# EAGLE design Skaarhoj BI8-SE-C201 (EAGLE 6.2)
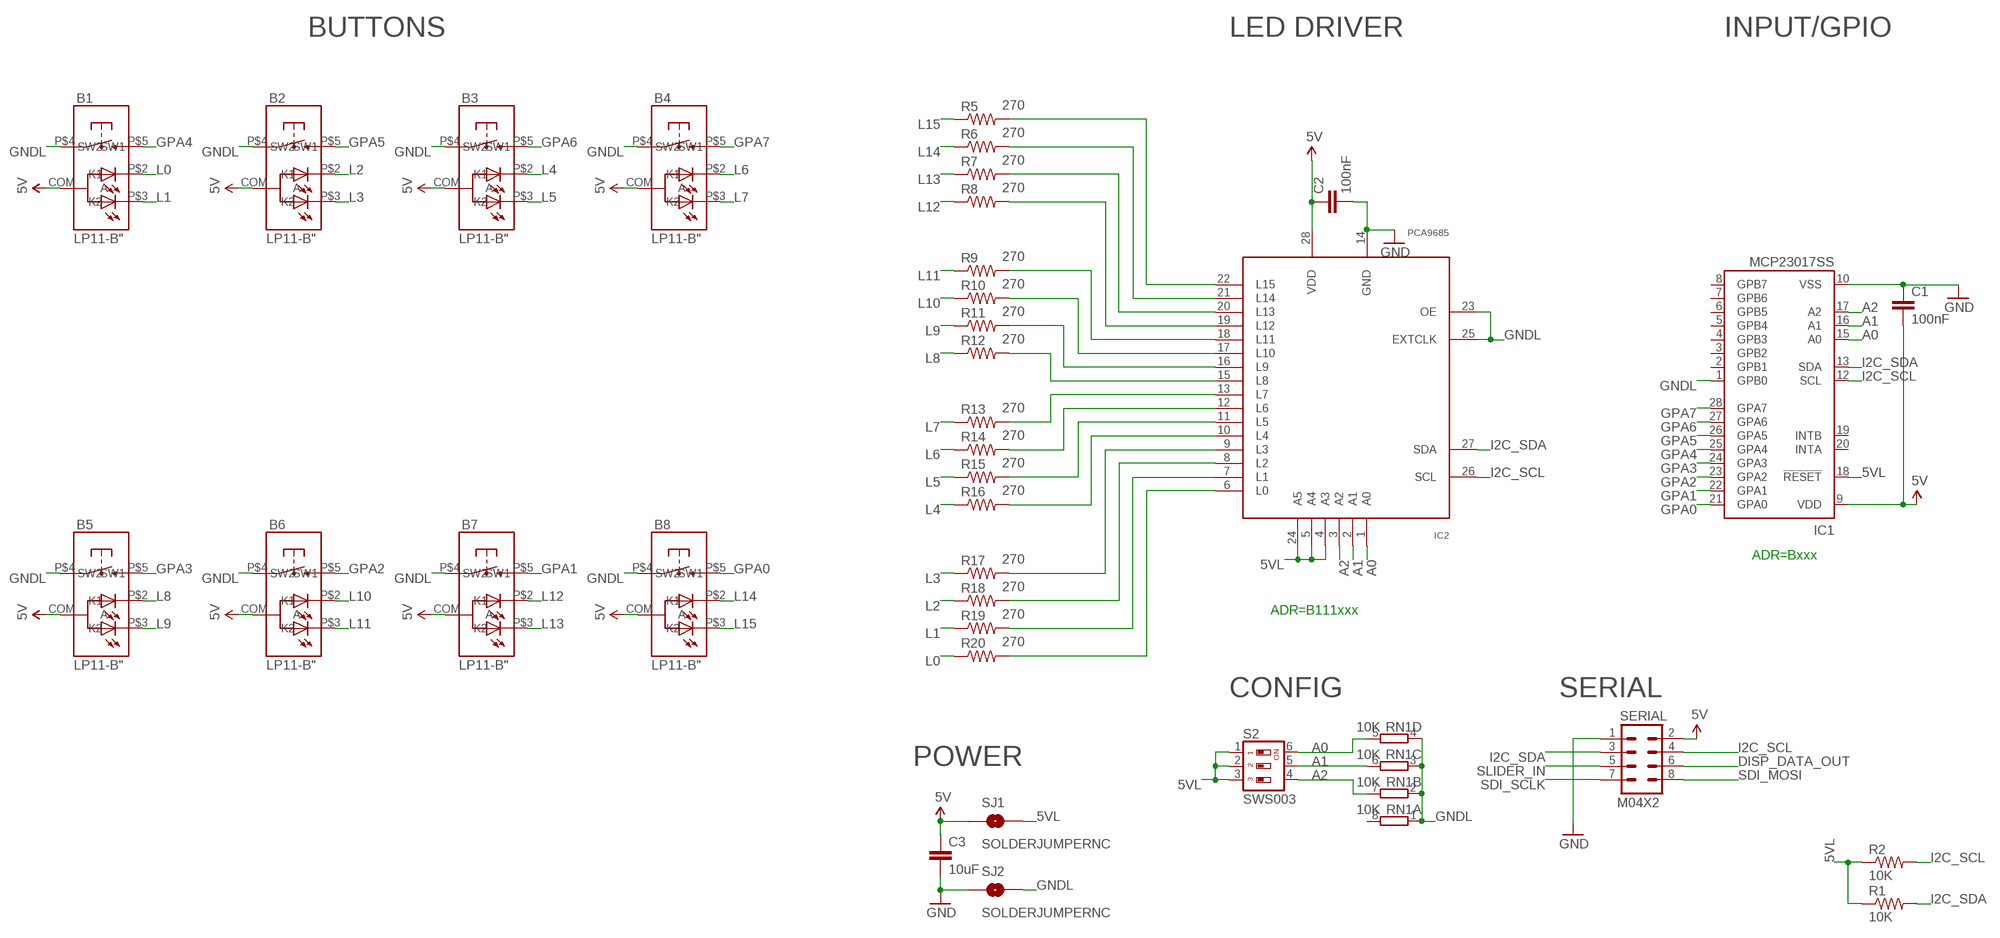
[diagram p0: schematic, sheet 1]

## Parts
B1  LP11-B"  [LP11]
B2  LP11-B"  [LP11]
B3  LP11-B"  [LP11]
B4  LP11-B"  [LP11]
B5  LP11-B"  [LP11]
B6  LP11-B"  [LP11]
B7  LP11-B"  [LP11]
B8  LP11-B"  [LP11]
C1  100nF  CAP0603-CAP  [0603-CAP]
C2  100nF  CAP0603-CAP  [0603-CAP]
C3  10uF  CAP0805  [0805]
IC1  MCP23017SS  [SSOP28]
IC2  PCA9685  [TSSOP28]
R1  10K  RESISTOR0603-RES  [0603-RES]
R2  10K  RESISTOR0603-RES  [0603-RES]
R5  270  RESISTOR0603-RES  [0603-RES]
R6  270  RESISTOR0603-RES  [0603-RES]
R7  270  RESISTOR0603-RES  [0603-RES]
R8  270  RESISTOR0603-RES  [0603-RES]
R9  270  RESISTOR0603-RES  [0603-RES]
R10  270  RESISTOR0603-RES  [0603-RES]
R11  270  RESISTOR0603-RES  [0603-RES]
R12  270  RESISTOR0603-RES  [0603-RES]
R13  270  RESISTOR0603-RES  [0603-RES]
R14  270  RESISTOR0603-RES  [0603-RES]
R15  270  RESISTOR0603-RES  [0603-RES]
R16  270  RESISTOR0603-RES  [0603-RES]
R17  270  RESISTOR0603-RES  [0603-RES]
R18  270  RESISTOR0603-RES  [0603-RES]
R19  270  RESISTOR0603-RES  [0603-RES]
R20  270  RESISTOR0603-RES  [0603-RES]
RN1  10K  4R-NCAY16  [CAY16_HAND]
S2  SWS003  [SMS-003]
SERIAL  M04X2  [2X4]
SJ1  SOLDERJUMPERNC  [SJ_2S]
SJ2  SOLDERJUMPERNC  [SJ_2S]

## Nets
5V [Power]: B1.COM(A) B2.COM(A) B3.COM(A) B4.COM(A) B5.COM(A) B6.COM(A) B7.COM(A) B8.COM(A) C1.2 C2.1 C3.1 IC1.9(VDD) IC2.28(VDD) SERIAL.2 SJ1.1
5VL: IC1.18(!RESET) IC2.4(A3) IC2.5(A4) IC2.24(A5) R1.1 R2.1 S2.1 S2.2 S2.3 SJ1.2
A0: IC1.15(A0) IC2.1(A0) RN1.5 S2.6
A1: IC1.16(A1) IC2.2(A1) RN1.6 S2.5
A2: IC1.17(A2) IC2.3(A2) RN1.7 S2.4
DISP_DATA_OUT: SERIAL.6
GND [Power]: C1.1 C2.2 C3.2 IC1.10(VSS) IC2.14(GND) SERIAL.1 SJ2.1
GNDL: B1.P$4(SW1) B2.P$4(SW1) B3.P$4(SW1) B4.P$4(SW1) B5.P$4(SW1) B6.P$4(SW1) B7.P$4(SW1) B8.P$4(SW1) IC1.1(GPB0) IC2.23(OE) IC2.25(EXTCLK) RN1.1 RN1.2 RN1.3 RN1.4 SJ2.2
GPA0: B8.P$5(SW2) IC1.21(GPA0)
GPA1: B7.P$5(SW2) IC1.22(GPA1)
GPA2: B6.P$5(SW2) IC1.23(GPA2)
GPA3: B5.P$5(SW2) IC1.24(GPA3)
GPA4: B1.P$5(SW2) IC1.25(GPA4)
GPA5: B2.P$5(SW2) IC1.26(GPA5)
GPA6: B3.P$5(SW2) IC1.27(GPA6)
GPA7: B4.P$5(SW2) IC1.28(GPA7)
I2C_SCL: IC1.12(SCL) IC2.26(SCL) R2.2 SERIAL.4
I2C_SDA: IC1.13(SDA) IC2.27(SDA) R1.2 SERIAL.3
L0: B1.P$2(K1) R20.1
L1: B1.P$3(K2) R19.1
L2: B2.P$2(K1) R18.1
L3: B2.P$3(K2) R17.1
L4: B3.P$2(K1) R16.1
L5: B3.P$3(K2) R15.1
L6: B4.P$2(K1) R14.1
L7: B4.P$3(K2) R13.1
L8: B5.P$2(K1) R12.1
L9: B5.P$3(K2) R11.1
L10: B6.P$2(K1) R10.1
L11: B6.P$3(K2) R9.1
L12: B7.P$2(K1) R8.1
L13: B7.P$3(K2) R7.1
L14: B8.P$2(K1) R6.1
L15: B8.P$3(K2) R5.1
N$4: IC2.13(L7) R13.2
N$5: IC2.12(L6) R14.2
N$7: IC2.11(L5) R15.2
N$9: IC2.10(L4) R16.2
N$10: IC2.9(L3) R17.2
N$11: IC2.8(L2) R18.2
N$12: IC2.7(L1) R19.2
N$19: IC2.6(L0) R20.2
N$20: IC2.15(L8) R12.2
N$21: IC2.16(L9) R11.2
N$22: IC2.17(L10) R10.2
N$23: IC2.18(L11) R9.2
N$24: IC2.19(L12) R8.2
N$25: IC2.20(L13) R7.2
N$26: IC2.21(L14) R6.2
N$27: IC2.22(L15) R5.2
SDI_MOSI: SERIAL.8
SDI_SCLK: SERIAL.7
SLIDER_IN: SERIAL.5
Unconnected: IC1.2(GPB1) IC1.3(GPB2) IC1.4(GPB3) IC1.5(GPB4) IC1.6(GPB5) IC1.7(GPB6) IC1.8(GPB7) IC1.19(INTB) IC1.20(INTA) RN1.8

## Notes on the sheet
- BUTTONS | LED DRIVER | INPUT/GPIO
- ADR=Bxxx
- ADR=B111xxx
- CONFIG | SERIAL
- POWER

## Library data of the parts
B1-B8 = SKAARHOJ:LP11-B
C1-C3 = SparkFun:CAP: Capacitor Standard 0603 ceramic capacitor, and 0.1" leaded capacitor.
IC1 = microchip:MCP23017: http://ww1.microchip.com/downloads/en/DeviceDoc/21952a.pdf Source: http://ww1.microchip.com/downloads/en/DeviceDoc/21952a.pdf; MF: MICROCHIP; MPN: MCP23017-E/SS; OC_FARNELL: 1467674; OC_NEWARK: 31K2960
IC2 = wsmith:PCA9685
R1 R2 R5-R20 = SparkFun:RESISTOR: Resistor Basic schematic elements and footprints for 0603, 1206, and PTH resistors.
RN1 = SKAARHOJ:4R-N: Array Chip Resistor Source: RS Component / Phycomp; OC_FARNELL: unknown; OC_NEWARK: unknown
S2 = smd-special:SWS003: SMD Dip Switch 3 pol.
SERIAL = SparkFun:M04X2
SJ1 SJ2 = SparkFun:SOLDERJUMPER: Solder Jumper Standard SMD solder jumper. Used to automate production. Two varients : Normally Open and Normally Closed are the same, but have different paste layers. NC will have a large amount of paste and should jumper during reflow.

## Net classes
0 default: width 0.203 mm, drill 0.406 mm, clearance 0.203 mm
1 Power: width 0.406 mm, drill 0.61 mm, clearance 0.203 mm

## Board
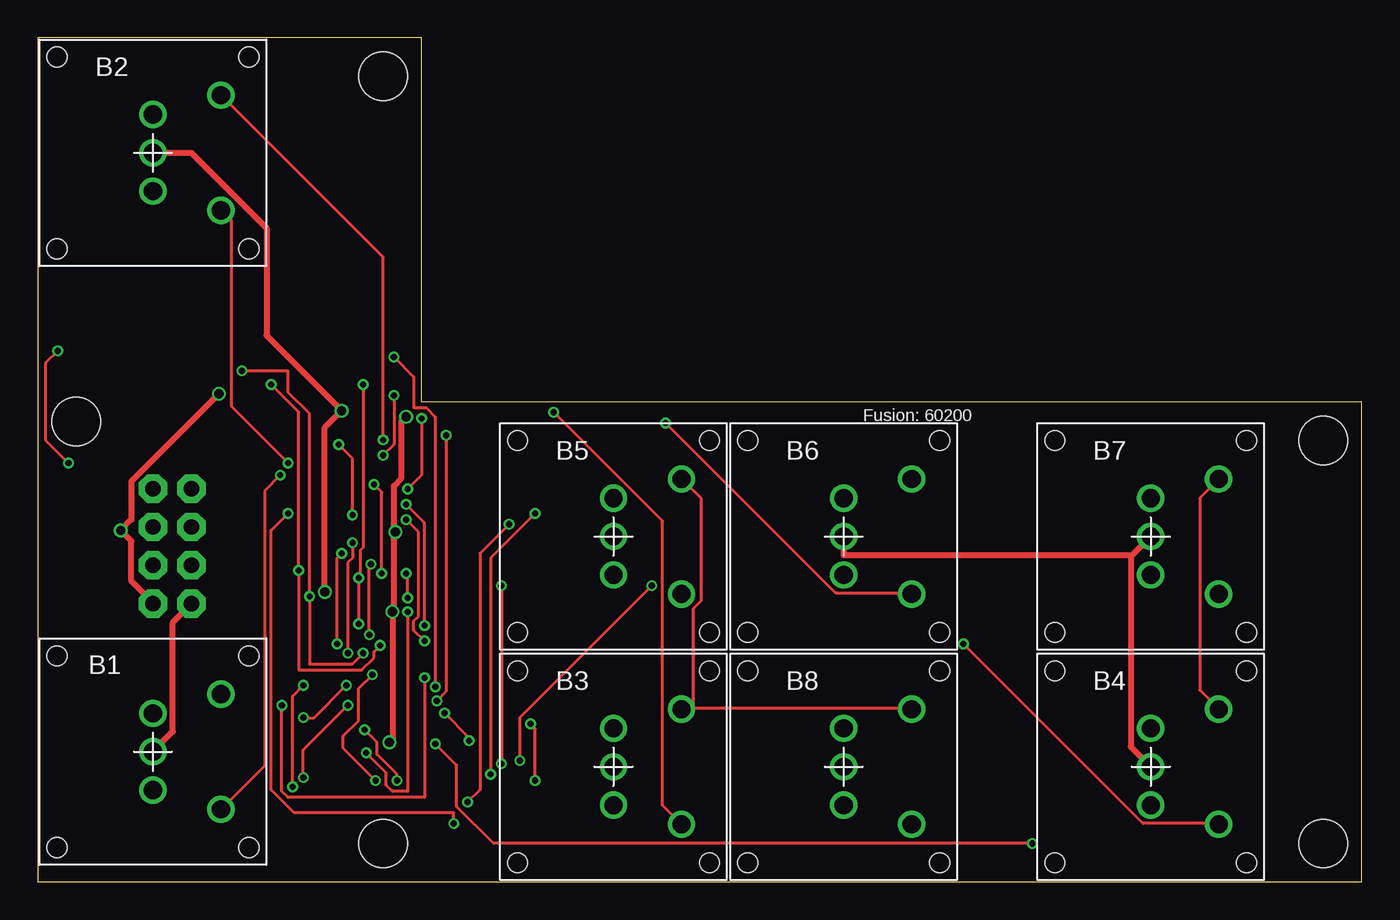
[diagram p1: board, top side]
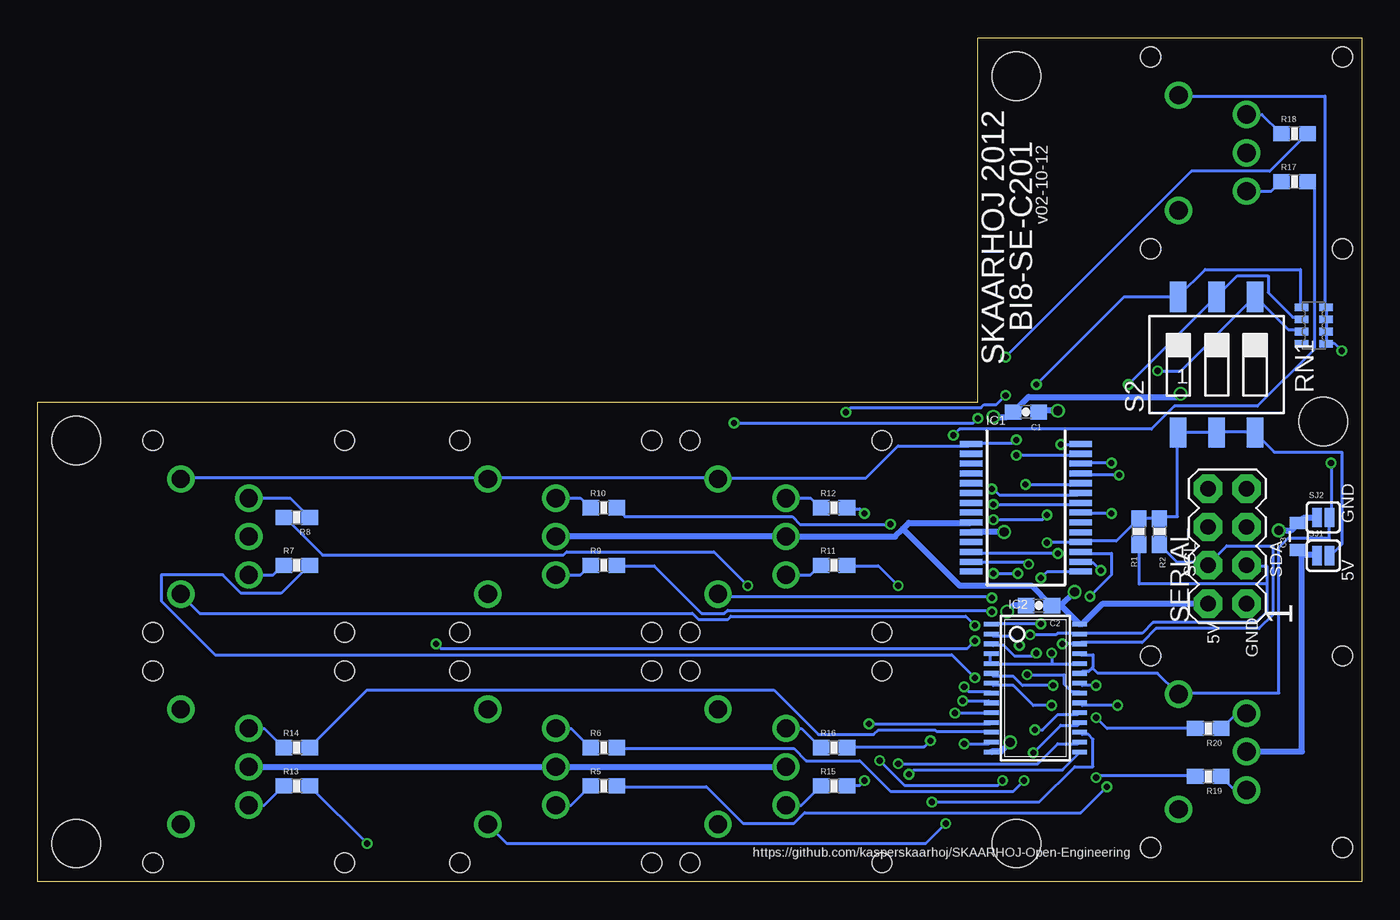
[diagram p2: board, bottom side, seen from below]

Size 87.63 x 55.88 mm. Coordinates in mm from the lower left corner, seen from the top.
Outline: 0,0 87.63,0 87.63,31.75 25.4,31.75 25.4,55.88 0,55.88 0,0
Copper layers (1*16): Top 0.035mm / dielectric 1.5mm / Bottom 0.035mm
Design rules: minimum track width 6mil, minimum drill 12mil, track to track 6mil, track to pad 6mil, pad to pad 6mil, via to via 6mil, smd to smd 0mil, copper to edge 10mil, drill to drill 10mil, minimum pad ring 10mil, minimum via ring 6mil, stop-mask expansion 2mil, vias tented up to drill 100mil, thermal gap 10mil
Holes 3.2 mm at 22.86,53.34 22.86,2.54 85.09,2.54 85.09,29.21 2.54,30.48

### Footprints (pad centres in the part's own frame; a part is rotated, then mirrored left to right if it is on the bottom)
LP11 = drill 1.2: COM 0,0; P$2 0,2.54; P$3 0,-2.54; P$4 4.5,3.81; P$5 4.5,-3.81 | hole 1.3: -6.35,6.35; 6.35,6.35; 6.35,-6.35; -6.35,-6.35
0603-CAP = smd 1.1 x 1: 1 -0.85,0; 2 0.85,0
0805 = smd 0.8 x 1.2: 1 -0.9,0; 2 0.9,0
SSOP28 = smd 0.4 x 1.5: 1 -4.225,-3.625; 2 -3.575,-3.625; 3 -2.925,-3.625; 4 -2.275,-3.625; 5 -1.625,-3.625; 6 -0.975,-3.625; 7 -0.325,-3.625; 8 0.325,-3.625; 9 0.975,-3.625; 10 1.625,-3.625; 11 2.275,-3.625; 12 2.925,-3.625; 13 3.575,-3.625; 14 4.225,-3.625; 15 4.225,3.625; 16 3.575,3.625; 17 2.925,3.625; 18 2.275,3.625; 19 1.625,3.625; 20 0.975,3.625; 21 0.325,3.625; 22 -0.325,3.625; 23 -0.975,3.625; 24 -1.625,3.625; 25 -2.275,3.625; 26 -2.925,3.625; 27 -3.575,3.625; 28 -4.225,3.625
TSSOP28 = smd 0.305 x 0.991: 1 -4.225,-2.918; 2 -3.575,-2.918; 3 -2.925,-2.918; 4 -2.275,-2.918; 5 -1.625,-2.918; 6 -0.975,-2.918; 7 -0.325,-2.918; 8 0.325,-2.918; 9 0.975,-2.918; 10 1.625,-2.918; 11 2.275,-2.918; 12 2.925,-2.918; 13 3.575,-2.918; 14 4.225,-2.918; 15 4.225,2.918; 16 3.575,2.918; 17 2.925,2.918; 18 2.275,2.918; 19 1.625,2.918; 20 0.975,2.918; 21 0.325,2.918; 22 -0.325,2.918; 23 -0.975,2.918; 24 -1.625,2.918; 25 -2.275,2.918; 26 -2.925,2.918; 27 -3.575,2.918; 28 -4.225,2.918
0603-RES = smd 1.1 x 1: 1 -0.85,0; 2 0.85,0
CAY16_HAND = smd 0.5 x 0.904: 1 -1.2,-0.813; 2 -0.4,-0.813; 3 0.4,-0.813; 4 1.2,-0.813; 5 1.2,0.813; 6 0.4,0.813; 7 -0.4,0.813; 8 -1.2,0.813
SMS-003 = smd 1.092 x 2.007: 1 -2.54,-4.496; 2 0,-4.496; 3 2.54,-4.496; 4 2.54,4.496; 5 0,4.496; 6 -2.54,4.496
2X4 = drill 1.016 pad 1.88 octagon: 1 -3.81,-1.27; 2 -3.81,1.27; 3 -1.27,-1.27; 4 -1.27,1.27; 5 1.27,-1.27; 6 1.27,1.27; 7 3.81,-1.27; 8 3.81,1.27
SJ_2S = smd 0.635 x 1.27: 1 -0.412,0; 2 0.412,0

### Placement (x,y rotation side)
B1  7.62,8.62 0 top
B2  7.62,48.26 0 top
B3  38.1,7.62 0 top
B4  73.66,7.62 0 top
B5  38.1,22.86 0 top
B6  53.34,22.86 0 top
B7  73.66,22.86 0 top
B8  53.34,7.62 0 top
C1  22.23,31.11 0 bottom
C2  21.36,18.29 180 bottom
C3  4.17,22.86 90 bottom
IC1  22.23,24.77 270 bottom
IC2  21.59,12.83 270 bottom
R1  14.76,23.19 270 bottom
R2  13.39,23.19 270 bottom
R5  50.16,6.35 0 bottom
R6  50.16,8.89 0 bottom
R7  70.48,20.95 0 bottom
R8  70.48,24.13 180 bottom
R9  50.16,20.95 0 bottom
R10  50.16,24.77 0 bottom
R11  34.92,20.95 0 bottom
R12  34.92,24.77 0 bottom
R13  70.48,6.35 0 bottom
R14  70.48,8.89 0 bottom
R15  34.92,6.35 0 bottom
R16  34.92,8.89 0 bottom
R17  4.45,46.35 0 bottom
R18  4.45,49.53 0 bottom
R19  10.16,6.99 180 bottom
R20  10.16,10.16 180 bottom
RN1  3.17,36.83 90 bottom
S2  9.6,34.24 0 bottom
SERIAL  8.89,22.23 90 bottom
SJ1  2.54,21.59 0 bottom
SJ2  2.54,24.13 0 bottom

### Tracks (layer width: path | path; a pad name or v marks a point on that pad's centre or on a via)
5V  (via drill 0.61)
  Top 0.406: B4.COM 72.34,8.94 72.34,21.54 | B7.COM 72.34,21.54 | B2.COM 10.16,48.26 15.14,43.28 15.14,36.17 v20.12,31.19 19,30.07 v19,19.2 | SERIAL.2 10.16,18.39 8.94,17.17 8.94,9.96 7.62,8.64 B1.COM | B6.COM 53.34,21.64 72.24,21.64 72.34,21.54
  Bottom 0.406: B3.COM B8.COM B4.COM | v20.12,31.19 21.34,31.19 C1.2 | 19.91,18.29 18.69,17.07 IC2.28 18.49,17.07 17.17,18.39 10.16,18.39 SERIAL.2 | 19.91,18.29 C2.1 20.62,18.39 21.84,19.61 26.62,19.61 30.38,23.37 | 3.86,21.64 4.17,21.95 C3.1 | 3.86,21.64 3.05,21.64 SJ1.1 | 3.86,21.64 3.96,21.54 3.96,8.64 7.62,8.64 B1.COM | 30.38,23.37 30.89,22.86 B5.COM B6.COM | 30.38,23.37 29.97,23.77 25.91,23.77 IC1.9 | 19.91,18.29 v19,19.2
5VL  (via drill 0.41)
  Top 0.203: v20.52,15.14 20.52,21.13 20.83,21.44 v20.83,22.45
  Bottom 0.203: SJ1.2 2.03,21.64 1.32,22.35 1.32,28.45 5.79,28.45 7.01,29.67 S2.3 7.11,29.77 9.55,29.77 S2.2 9.65,29.77 12.09,29.77 S2.1 12.19,29.67 12.19,24.18 13.41,24.18 R2.1 13.41,24.08 14.73,24.08 R1.1 14.83,23.98 16.26,22.55 18.59,22.55 IC1.18 18.69,22.45 v20.83,22.45 | 20.52,14.43 24.49,14.43 IC2.5 24.59,14.53 24.59,15.04 IC2.4 | 20.52,14.43 18.69,14.43 IC2.24 | v20.52,15.14 20.52,14.43
A0  (via drill 0.41)
  Top 0.203: v21.23,17.07 v21.23,20.12 21.34,20.22 21.34,21.95 21.54,22.15 v21.54,32.92
  Bottom 0.203: v21.23,17.07 24.49,17.07 IC2.1 | v21.23,20.12 20.83,20.52 18.69,20.52 IC1.15 | RN1.5 4.06,38.1 4.06,40.54 10.36,40.54 12.09,38.81 S2.6 12.19,38.71 15.75,38.71 v21.54,32.92
A1  (via drill 0.41)
  Top 0.203: v22.66,15.65 22.25,15.24 22.25,14.83 21.44,14.02 17.27,14.02 v17.27,20.62 17.27,31.09 v15.44,32.92
  Bottom 0.203: RN1.6 4.06,37.29 4.17,37.39 4.57,37.39 6.2,39.01 6.2,40.13 8.23,40.13 9.55,38.81 S2.5 9.65,38.71 v15.44,32.92 | v22.66,15.65 23.27,16.26 24.38,16.26 24.49,16.36 IC2.2 | v17.27,20.62 17.78,21.13 18.59,21.13 IC1.16
A2  (via drill 0.41)
  Top 0.203: v21.54,15.14 20.83,14.43 17.98,14.43 v17.98,18.9 17.98,30.99 16.56,32.41 16.56,33.83 v13.51,33.83
  Bottom 0.203: RN1.7 4.06,36.47 4.17,36.58 4.88,36.58 7.01,38.71 S2.4 7.11,38.71 11.99,33.83 v13.51,33.83 | v21.54,15.14 21.74,14.94 22.96,14.94 23.67,15.65 24.38,15.65 24.49,15.75 IC2.3 | v17.98,18.9 16.56,20.32 16.56,21.74 18.59,21.74 IC1.17
GND  (via drill 0.61)
  Top 0.406: SERIAL.1 7.62,18.49 6.2,19.91 6.2,22.55 v5.49,23.27 6.2,23.98 6.2,26.52 v11.99,32.31 | v23.27,9.25 23.47,9.45 v23.47,17.88 23.57,17.98 23.57,23.16 | v24.38,30.79 24.08,30.48 24.08,26.72 23.57,26.21 23.57,23.16 | v23.67,23.16 23.57,23.16
  Bottom 0.406: SJ2.1 3.05,24.08 3.86,24.08 4.17,23.77 C3.2 4.27,23.67 4.67,23.27 v5.49,23.27 | v23.27,9.25 23.88,8.64 24.49,8.64 IC2.14 | v23.47,17.88 23.06,18.29 C2.2 | v24.38,30.79 23.47,30.79 23.16,31.09 C1.1 22.96,31.19 22.05,32.11 12.19,32.11 v11.99,32.31 | v23.67,23.16 25.81,23.16 IC1.10
GNDL  (via drill 0.41)
  Top 0.203: B4.P$4 78.13,11.48 76.91,12.7 76.91,25.4 78.13,26.62 B7.P$4 | 43.38,11.48 57.81,11.48 B8.P$4 | 43.38,11.48 42.67,11.48 B3.P$4 43.38,11.48 | 43.38,11.48 43.38,18.09 43.89,18.59 43.89,25.4 42.67,26.62 B5.P$4 | v22.86,29.26 22.86,41.35 12.19,52.02 B2.P$4 | v2.03,27.74 0.51,29.26 0.51,34.34 v1.32,35.15
  Bottom 0.203: 17.83,14.17 17.78,14.22 17.78,15.04 18.59,15.04 IC2.25 | 17.83,14.17 18.09,13.92 18.49,13.92 18.59,13.82 IC2.23 | 17.83,14.17 17.48,13.82 13.51,13.82 12.19,12.5 B1.P$4 12.09,12.5 5.49,12.5 5.49,22.15 4.88,22.76 2.13,22.76 2.13,24.08 SJ2.2 2.03,24.18 v2.03,27.74 | B2.P$4 12.09,52.02 2.44,52.02 2.44,38.1 RN1.4 2.34,38 2.34,37.29 RN1.3 2.34,37.19 2.34,36.47 RN1.2 2.34,36.37 2.34,35.66 RN1.1 2.23,35.66 1.83,35.66 v1.32,35.15 | B7.P$4 78.13,26.72 57.91,26.72 B6.P$4 57.81,26.72 42.67,26.72 B5.P$4 42.57,26.72 32.82,26.72 30.68,28.85 26.01,28.85 25.91,28.96 IC1.1 25.81,29.06 23.06,29.06 v22.86,29.26
GPA0  (via drill 0.41)
  Top 0.203: v16.56,24.38 15.44,23.27 15.44,6.1 16.97,4.57 27.53,4.57 v27.53,3.86
  Bottom 0.203: v16.56,24.38 18.59,24.38 IC1.21 | v27.53,3.86 28.85,2.54 56.59,2.54 57.81,3.76 B8.P$5
GPA1  (via drill 0.41)
  Top 0.203: v24.38,24.99 25.6,23.77 v25.6,16.97
  Bottom 0.203: v24.38,24.99 18.69,24.99 IC1.22 | v25.6,16.97 26.21,17.58 41.76,17.58 41.96,17.37 43.89,17.37 44.3,17.78 76.91,17.78 78.13,19 B7.P$5
GPA2  (via drill 0.41)
  Top 0.203: v24.49,26.01 25.4,26.92 v25.4,30.68 | v41.55,30.38 52.83,19.1 57.81,19.1 B6.P$5
  Bottom 0.203: v24.49,26.01 24.38,26.01 23.98,25.6 18.8,25.6 18.69,25.7 IC1.23 | v25.4,30.68 25.7,30.38 v41.55,30.38
GPA3  (via drill 0.41)
  Top 0.203: v22.25,26.31 22.76,25.81 v22.76,20.42 | v24.38,20.42 24.49,20.32 v24.49,18.8
  Bottom 0.203: v22.25,26.31 18.69,26.31 IC1.24 | v24.38,20.42 v22.76,20.42 | v24.49,18.8 24.59,18.9 42.47,18.9 42.57,19 B5.P$5
GPA4  (via drill 0.41)
  Top 0.203: v16.05,26.92 15.04,25.91 15.04,7.72 12.19,4.88 B1.P$5
  Bottom 0.203: v16.05,26.92 18.49,26.92 18.59,27.03 IC1.25
GPA5  (via drill 0.41)
  Top 0.203: v16.56,27.74 12.8,31.5 12.8,43.79 12.19,44.4 B2.P$5
  Bottom 0.203: v16.56,27.74 18.59,27.74 IC1.26
GPA6  (via drill 0.41)
  Top 0.203: v22.86,28.25 23.57,28.96 v23.57,32.21 | v34.14,31.09 41.35,23.88 41.35,5.08 42.57,3.86 B3.P$5
  Bottom 0.203: v22.86,28.25 18.69,28.25 IC1.27 | v23.57,32.21 24.18,31.6 24.99,31.6 25.2,31.39 33.83,31.39 v34.14,31.09
GPA7  (via drill 0.41)
  Top 0.203: v19.91,28.96 20.83,28.04 v20.83,24.28 | v24.38,23.98 25.2,23.16 25.2,17.58 24.89,17.27 24.89,16.66 v25.6,15.95 | v61.27,15.75 73.15,3.86 78.13,3.86 B4.P$5
  Bottom 0.203: v19.91,28.96 18.69,28.96 IC1.28 | v20.83,24.28 21.13,23.98 v24.38,23.98 | v25.6,15.95 26.11,15.44 60.96,15.44 v61.27,15.75
I2C_SCL  (via drill 0.41)
  Top 0.203: v20.12,21.74 19.81,21.44 v19.81,15.75
  Bottom 0.203: R2.2 13.31,22.25 12.19,21.13 10.16,21.13 SERIAL.4 10.16,21.03 8.94,22.25 5.89,22.25 5.89,17.68 6.81,16.76 13.61,16.76 14.53,15.85 18.59,15.85 IC2.26 18.69,15.75 v19.81,15.75 | v20.12,21.74 25.81,21.74 IC1.12
I2C_SDA  (via drill 0.41)
  Top 0.203: v22.05,21.03 21.95,20.93 v21.95,16.36
  Bottom 0.203: 6.3,19.71 6.3,20.93 7.62,20.93 SERIAL.3 | 6.3,19.71 6.3,17.88 7.01,17.17 13.82,17.17 14.53,16.46 18.59,16.46 IC2.27 18.69,16.46 20.12,16.46 20.22,16.36 v21.95,16.36 | 6.3,19.71 14.73,19.71 14.73,22.25 R1.2 | v22.05,21.03 22.15,21.13 25.81,21.13 IC1.13
L0
  Bottom 0.203: R20.1 9.25,10.16 8.33,11.07 7.62,11.07 B1.P$2
L1
  Bottom 0.203: R19.1 9.25,6.91 8.43,6.1 7.62,6.1 B1.P$3
L2
  Bottom 0.203: B2.P$2 6.6,50.8 5.38,49.58 R18.1
L3
  Bottom 0.203: B2.P$3 5.99,45.72 5.38,46.33 R17.1
L4
  Bottom 0.203: B3.P$2 37.08,10.16 35.87,8.94 R16.1
L5
  Bottom 0.203: B3.P$3 37.08,5.08 35.87,6.3 R15.1
L6
  Bottom 0.203: B4.P$2 72.64,10.16 71.42,8.94 R14.1
L7
  Bottom 0.203: B4.P$3 72.64,5.08 71.42,6.3 R13.1
L8
  Bottom 0.203: B5.P$2 36.47,25.4 35.87,24.79 R12.1
L9
  Bottom 0.203: B5.P$3 36.47,20.32 35.87,20.93 R11.1
L10
  Bottom 0.203: B6.P$2 51.71,25.4 51.1,24.79 R10.1
L11
  Bottom 0.203: B6.P$3 51.71,20.32 51.1,20.93 R9.1
L12
  Bottom 0.203: B7.P$2 70.92,25.4 69.7,24.18 R8.1
L13
  Bottom 0.203: B7.P$3 72.03,20.32 71.42,20.93 R7.1
L14
  Bottom 0.203: B8.P$2 52.32,10.16 51.1,8.94 R6.1
L15
  Bottom 0.203: B8.P$3 52.32,5.08 51.1,6.3 R5.1
N$4  (via drill 0.41)
  Top 0.203: v26.31,9.14 27.74,7.72 27.74,4.98 30.18,2.54 v65.84,2.54
  Bottom 0.203: v26.31,9.14 24.69,9.14 24.59,9.25 IC2.13 | v65.84,2.54 69.6,6.3 R13.2
N$5
  Bottom 0.203: IC2.12 24.59,9.96 28.14,9.96 28.25,10.06 32,10.06 32.31,9.75 35.97,9.75 38.91,12.7 65.84,12.7 69.6,8.94 R14.2
N$7  (via drill 0.41)
  Top 0.203: v32.61,10.46 32.92,10.16 v32.92,6.71
  Bottom 0.203: v32.61,10.46 24.59,10.46 IC2.11 | v32.92,6.71 33.22,6.4 34.04,6.4 R15.2
N$9  (via drill 0.41)
  Top 0.203: v26.92,11.18 28.55,9.55 v28.55,9.35
  Bottom 0.203: v26.92,11.18 24.59,11.18 IC2.10 | v28.55,9.35 28.96,8.94 34.04,8.94 R16.2
N$10  (via drill 0.41)
  Top 0.203: v26.42,11.99 27.03,12.6 v27.03,29.57
  Bottom 0.203: v26.42,11.99 24.69,11.99 24.59,11.89 IC2.9 | v27.03,29.57 26.62,29.97 13.92,29.97 12.39,31.5 6.91,31.5 3.15,35.26 3.15,46.33 3.56,46.33 R17.2
N$11  (via drill 0.41)
  Top 0.203: v26.31,12.9 26.31,30.79 25.7,31.39 24.89,31.39 24.89,33.43 v23.57,34.75
  Bottom 0.203: v26.31,12.9 26.01,12.6 24.59,12.6 IC2.8 | v23.57,34.75 11.28,47.04 6.1,47.04 3.66,49.48 R18.2
N$12  (via drill 0.41)
  Top 0.203: v20.52,11.68 17.58,8.74 v17.58,6.91
  Bottom 0.203: v20.52,11.68 21.74,11.68 23.06,13.01 24.38,13.01 24.49,13.11 IC2.7 | v17.58,6.91 17.48,7.01 11.07,7.01 R19.2
N$19  (via drill 0.41)
  Top 0.203: v20.42,13.01 18.29,10.87 v17.58,10.87
  Bottom 0.203: v20.42,13.01 22.45,13.01 23.06,13.61 24.38,13.61 24.49,13.72 IC2.6 | v17.58,10.87 16.87,10.16 R20.2
N$20  (via drill 0.41)
  Top 0.203: v29.97,7.11 29.97,21.44 v32.92,24.38
  Bottom 0.203: v29.97,7.11 29.67,7.42 19.81,7.42 18.69,8.53 IC2.15 | v32.92,24.38 33.22,24.69 34.04,24.69 R12.2
N$21  (via drill 0.41)
  Top 0.203: v30.68,19.61 v30.68,7.82
  Bottom 0.203: v30.68,7.82 21.44,7.82 20.12,9.14 18.8,9.14 18.69,9.25 IC2.16 | v30.68,19.61 32,20.93 34.04,20.93 R11.2
N$22  (via drill 0.41)
  Top 0.203: v28.45,5.28 29.26,6.1 29.26,21.74 v31.19,23.67
  Bottom 0.203: v28.45,5.28 21.34,5.28 19,7.62 17.78,7.62 17.78,9.45 18.09,9.75 18.49,9.75 18.59,9.86 IC2.17 | v31.19,23.67 37.19,23.67 37.69,24.18 48.77,24.18 49.28,24.69 R10.2
N$23  (via drill 0.41)
  Top 0.203: v21.74,8.53 23.06,7.21 23.06,6.4 23.47,5.99 24.49,5.99 v24.49,17.88
  Bottom 0.203: v21.74,8.53 19.91,10.36 18.8,10.36 18.69,10.46 IC2.18 | v24.49,17.88 24.59,17.98 41.96,17.98 42.16,17.78 43.69,17.78 46.84,20.93 49.28,20.93 R9.2
N$24  (via drill 0.41)
  Top 0.203: v21.64,10.06 22.45,9.25 22.45,8.43 23.77,7.11 v23.77,6.71 | v31.9,8.03 31.9,10.87 v40.64,19.61
  Bottom 0.203: v21.64,10.06 21.13,10.06 20.12,11.07 18.8,11.07 18.69,11.18 IC2.19 | v23.77,6.71 24.08,6.4 30.28,6.4 v31.9,8.03 | v40.64,19.61 42.88,21.84 52.63,21.84 52.83,21.64 68.78,21.64 71.22,24.08 71.32,24.08 R8.2
N$25  (via drill 0.41)
  Top 0.203: v16.15,11.68 16.15,5.99 16.56,5.59 25.6,5.59 v25.6,13.51
  Bottom 0.203: v16.15,11.68 18.49,11.68 18.59,11.79 IC2.20 | v25.6,13.51 27.13,15.04 75.89,15.04 79.45,18.59 79.45,20.32 75.39,20.32 74.17,19.1 71.53,19.1 69.7,20.93 R7.2
N$26  (via drill 0.41)
  Top 0.203: v22.15,13.72 21.23,12.8 21.23,10.67 20.22,9.65 20.22,8.84 v22.35,6.71
  Bottom 0.203: v22.15,13.72 19.71,13.72 19.71,13.11 19.2,12.6 18.69,12.6 IC2.21 | v22.35,6.71 23.06,5.99 31.19,5.99 33.22,8.03 36.78,8.03 37.59,8.84 49.28,8.84 R6.2
N$27  (via drill 0.41)
  Top 0.203: v17.58,13.01 16.87,12.29 v16.87,6.3
  Bottom 0.203: v17.58,13.01 18.49,13.01 18.59,13.11 IC2.22 | v16.87,6.3 18.59,4.57 36.88,4.57 37.59,3.86 40.95,3.86 43.38,6.3 49.28,6.3 R5.2

### Text on the board
_tsilk: Fusion: 60200
_bsilk: SKAARHOJ 2012 | v02-10-12 | BI8-SE-C201 | GND | 5V | SDA | SCL | 1 | 5V | GND | https://github.com/kasperskaarhoj/SKAARHOJ-Open-Engineering